# Altium schematic sheet DC075B_TGC_SOURCE.SchDoc: TGC SOURCE
size 558 x 431 mm; Date: Not shown in title block; ApprovedBy: Not shown in title block; CheckedBy: Not shown in title block; Author: Not shown in title block; CompanyName: Not shown in title block; DrawnBy: Praveen Aroul; Engineer: Not shown in title block; Organization: Not shown in title block; Address1: Not shown in title block; Address2: Not shown in title block; Address3: Not shown in title block; Address4: Not shown in title block; DocumentNumber: 8; Revision: Use project parameter SCH_Rev; SheetNumber: 8; SheetTotal: 13; PageSetup: Record=PageOptions|CenterHorizontal=True|CenterVertical=True|PrintScale=1.00|XCorrection=1.00|YCorrection=1.00|PrintKind=0|BorderSize=5000000|LeftOffset=0|BottomOffset=0|Orientation=2|PaperLength=1000|PaperWidth=1000|Scale=100|PaperSource=15|PrintQuality=600|MediaType=1|DitherType=10|PaperKind=Letter|PrintScaleMode=1; CurrentTime: Not shown in title block; CurrentDate: Not shown in title block; Time: Not shown in title block; DocumentFullPathAndName: Not shown in title block; DocumentName: Not shown in title block; ModifiedDate: Not shown in title block; ImagePath: Not shown in title block
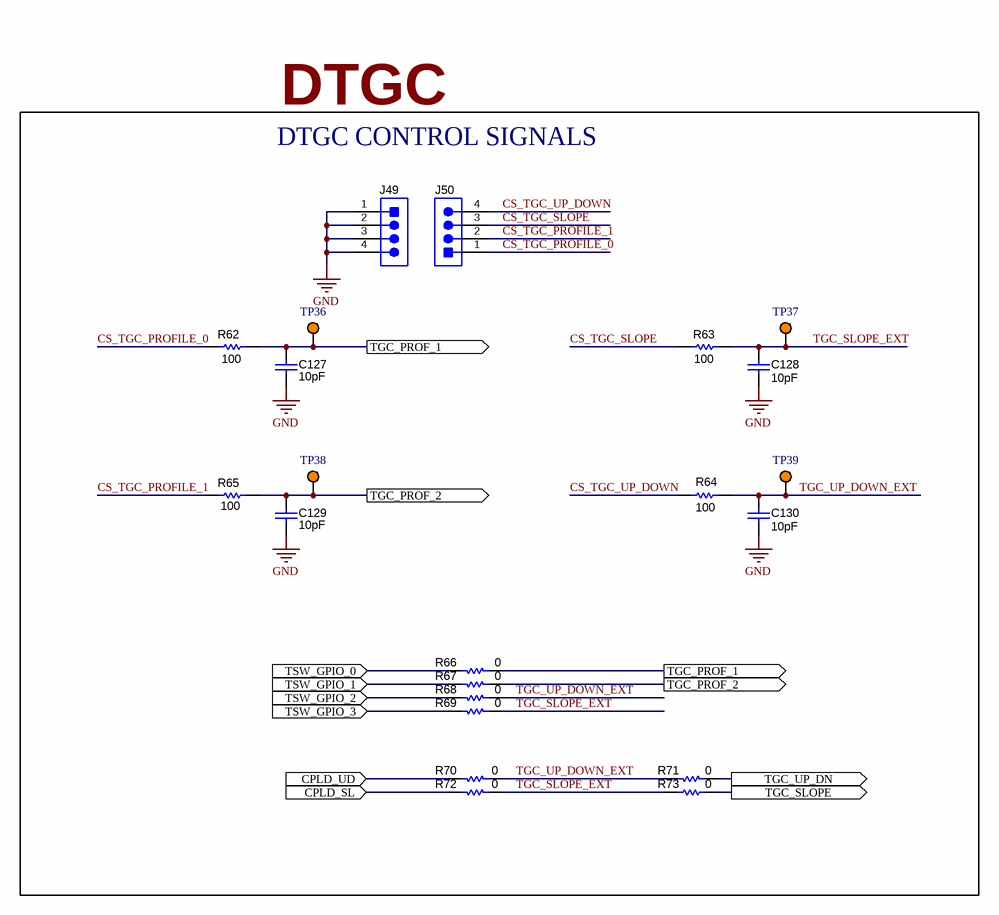
[diagram p0: DC075B_TGC_SOURCE.SchDoc]

## Parts
C127  ValueDisplayed: 10pF  [0402]  (hidden comment: C0402C100C8GACTU)
C128  value 10pF  [0402]  (hidden comment: Capacitor)
C129  ValueDisplayed: 10pF  [0402]  (hidden comment: C0402C100C8GACTU)
C130  value 10pF  [0402]  (hidden comment: Capacitor)
J49  Header_4x1  [TSW-104-07-G-S]  (value not drawn)
J50  Header_4x1  [TSW-104-07-G-S]  (value not drawn)
R62  value 100  [0603]  (hidden comment: Resistor)
R63  value 100  [0603]  (hidden comment: Resistor)
R64  value 100  [0603]  (hidden comment: Resistor)
R65  value 100  [0603]  (hidden comment: Resistor)
R66  value 0  [0402]  (hidden comment: Resistor)
R67  value 0  [0402]  (hidden comment: Resistor)
R68  value 0  [0402]  (hidden comment: Resistor)
R69  value 0  [0402]  (hidden comment: Resistor)
R70  value 0  [0402]  (hidden comment: Resistor)
R71  value 0  [0402]  (hidden comment: Resistor)
R72  value 0  [0402]  (hidden comment: Resistor)
R73  value 0  [0402]  (hidden comment: Resistor)
TP36  5003  [Keystone5003]  (value not drawn)
TP37  5003  [Keystone5003]  (value not drawn)
TP38  5003  [Keystone5003]  (value not drawn)
TP39  5003  [Keystone5003]  (value not drawn)

## Blocks framed on the sheet
DTGC CONTROL SIGNALS: C127-C130 J49 J50 R62-R73 TP36-TP39

## Ports
CPLD_SL (in), CPLD_UD (in), TGC_PROF_1 (out), TGC_PROF_2 (out), TGC_SLOPE (out), TGC_UP_DN (out), TSW_GPIO_0 (in), TSW_GPIO_1 (in), TSW_GPIO_2 (in), TSW_GPIO_3 (in)

## Nets
GND: C127.2 C128.2 C129.2 C130.2 J49.1 J49.2 J49.3 J49.4
CPLD_SL: R72.1 ; port CPLD_SL
CPLD_UD: R70.1 ; port CPLD_UD
CS_TGC_PROFILE_0: J50.1 R62.1
CS_TGC_PROFILE_1: J50.2 R65.1
CS_TGC_SLOPE: J50.3 R63.1
CS_TGC_UP_DOWN: J50.4 R64.1
TGC_PROF_1: C127.1 R62.2 R66.2 TP36.1 ; port TGC_PROF_1
TGC_PROF_2: C129.1 R65.2 R67.2 TP38.1 ; port TGC_PROF_2
TGC_SLOPE: R73.1 ; port TGC_SLOPE
TGC_SLOPE_EXT: C128.1 R63.2 R69.2 R72.2 R73.2 TP37.1
TGC_UP_DN: R71.1 ; port TGC_UP_DN
TGC_UP_DOWN_EXT: C130.1 R64.2 R68.2 R70.2 R71.2 TP39.1
TSW_GPIO_0: R66.1 ; port TSW_GPIO_0
TSW_GPIO_1: R67.1 ; port TSW_GPIO_1
TSW_GPIO_2: R68.1 ; port TSW_GPIO_2
TSW_GPIO_3: R69.1 ; port TSW_GPIO_3

## Notes on the sheet
- DTGC
- Drawn By:
- SVN Rev:
- Number:
- TID #:
- Orderable:
- Rev:
- Sheet Title:
- File:
- Project Title:
- Designed for:
- Assembly Variant:
- Mod. Date:
- Sheet:
- Size:
- of
- C
- http://www.ti.com
- Texas Instruments and/or its licensors do not warrant the accuracy or completeness of this specification or any information contained therein. Texas Instruments and/or its licensors do not warrant that this design will meet the specifications, will be suitable for your application or fit for any particular purpose, or will operate in an implementation. Texas Instruments and/or its licensors do not warrant that the design is production worthy. You should completely validate and test your design implementation to confirm the system functionality for your application.
- Engineer:
- Contact:
- © Texas Instruments

## Library data of the parts
C127 C129 = CMP-0064914-2: CAP, CERM, 10 pF, 10 V,+/- 2.5%, C0G/NP0, 0402; Manufacturer: Kemet; TaMin_C: -55°C; Polarized: N; SizeAreaWB_mm2: 3; Value1: Unknown; U/M: EA; Value: 10pF; TaMax_C: 125°C; SizeZ_mm: 0.6; SizeX_mm: 1; SizeY_mm: 0.5; Value2: 10V; CompType: Capacitor; AEC Category: Q200; Supplier Part Number 2: 96Y6847; Publisher: Texas Instruments; Supplier 2: Newark; Supplier Part Number 3: 80-C0402C100C8G; TempCo: C0G/NP0; Supplier 3: Mouser; Published: 2008-06-19; RoHS: Y; MountType: SMT; Supplier 1: Digi-Key; PackageReference: 0402; Tolerance_%: 2.5%; Cap_Case: 0402; SizeArea_mm2: 0.5; LatestRevisionDate: 2017-06-05; PartNumber: C0402C100C8GACTU; AEC Qualified: N; Cap_F: 10pF; VDC_V: 10V; ComponentLink1Description: Datasheet link; AEC Grade: N/A; Supplier Part Number 1: 399-8939-1-ND; Technology: Ceramic; ComponentLink1URL: http://www.kemet.com/docfinder?Partnumber=C0402C100C8GACTU
C128 C130 = CMP-0006408-2: CAP, CERM, 10 pF, 50 V, +/- 5%, C0G/NP0, 0402; PartNumber: GRM1555C1H100JA01D; Manufacturer: MuRata; Polarized: N; U/M: EA; Value1: Unknown; VDC_V: 50V; TaMin_C: -55°C; TaMax_C: 125°C; AEC Category: Q200; SizeArea_mm2: 0.5; SizeAreaWB_mm2: 3; SizeX_mm: 1; SizeZ_mm: 0.6; CompType: Capacitor; PackageReference: 0402; RoHS: Y; MountType: SMT; ComponentLink1Description: Datasheet link; ComponentLink1URL: http://search.murata.co.jp/Ceramy/PnsearchViewAction.do?HnOFG=ON&HnNFG=ON&SEL_CNT=50&sLang=en&sKey=GRM1555C1H100JA01D&x=9&y=9&search=startwith; ValueDisplayed: 10pF; Cap_F: 10pF; Tolerance_%: 5%; Value2: 50V; Technology: Ceramic; TempCo: C0G/NP0; Cap_Case: 0402; Published: 2008-06-19; Publisher: Texas Instruments; LatestRevisionDate: 2017-03-09; Supplier 1: Mouser; Supplier Part Number 1: 81-GRM1555C1H100JA1D; AEC Qualified: ?; SizeY_mm: 0.5
J49 J50 = CMP-0075409-2: Header, 100mil, 4x1, Gold, TH; Manufacturer: Samtec; Cert_CSA: Y; Cert_CULUS: N; Current_A: 6.3A; Gender: Male; Green_Lifecycle: Active; Green_REACh: Passed; Pitch_mm: 2.54; Row_Count: 1; Voltage_V: 550V; PartNumber: TSW-104-07-G-S; ClassName: Header; PackageReference: 4x1 Header; CompType: Header; RoHS: Y; MountType: TH; ComponentLink1Description: Datasheet URL; ComponentLink1URL: http://samtec.com/ftppub/pdf/TSW_TH.PDF; Supplier 1: Digi-Key; Supplier Part Number 1: SAM1029-04-ND; Cert_UL: Y; Cert_VDE: N; Color: Black; ContactFinish: Gold; Green_EU RoHS-2: Passed; Green_EU RoHS: Passed; Orientation: Vertical; PinCount: 4; Shrouded: N
R62-R65 = CMP-0021991-4: RES, 100, 1%, 0.1 W, AEC-Q200 Grade 0, 0603; Manufacturer: Vishay-Dale; PartNumber: CRCW0603100RFKEA; Value_Code: 100R; Power_W: 100mW; Value2: 0.1W; VDC_V: 75V; TempCo: 100 ppm/C; EIA_Code: E96; AEC Category: Q200; AEC Grade: 0; AEC Qualified: Y; SizeArea_mm2: 1.28; SizeX_mm: 1.6; SizeY_mm: 0.8; SizeZ_mm: 1; ComponentLink1Description: Datasheet link; ComponentLink1URL: http://www.vishay.com/docs/20035/dcrcwe3.pdf; CompType: Resistor; MountType: SMT; PackageReference: 0603; RoHS: E; ValueDisplayed: 100; Res_ohm: 100; Tolerance_%: 1%; Value1: 1%; Technology: Thick Film; Supplier 1: Digi-Key; Supplier Part Number 1: 541-100HCT-ND; Supplier 2: Newark; Supplier Part Number 2: 52K8078; Supplier 3: Mouser; Supplier Part Number 3: 71-CRCW0603-100-E3
R66-R73 = CMP-0026822-3: RES, 0, 5%, 0.063 W, AEC-Q200 Grade 0, 0402; Manufacturer: Vishay-Dale; PartNumber: CRCW04020000Z0ED; Value_Code: 0000; Power_W: 63mW; Value2: 0.063W; VDC_V: 50V; TempCo: 200 ppm/C; EIA_Code: E24; AEC Category: Q200; AEC Qualified: Y; SizeArea_mm2: 0.5; SizeX_mm: 1; SizeZ_mm: 0.6; ComponentLink1Description: Datasheet link; ComponentLink1URL: http://www.vishay.com/docs/20035/dcrcwe3.pdf; CompType: Resistor; MountType: SMT; PackageReference: 0402; RoHS: E; ValueDisplayed: 0; Res_ohm: 0; Tolerance_%: 5%; Value1: 5%; Technology: Thick Film; Supplier 1: Digi-Key; Supplier Part Number 1: 541-0.0JCT-ND; Supplier 2: Newark; Supplier Part Number 2: 52K6543; Supplier 3: Mouser; Supplier Part Number 3: 71-CRCW0402-0-E3; AEC Grade: 0; SizeY_mm: 0.5
TP36-TP39 = CMP-0055140-1: Test Point, Miniature, Orange, TH; Manufacturer: Keystone; CNHeader: FALSE; ContactFinish: Silver; CT: TRUE; Green_Lifecycle: Active; Green_REACh: Passed; PartNumber: 5003; PackageReference: Orange Miniature Testpoint; CompType: Test Point; RoHS: Y; MountType: TH; ComponentLink1Description: Datasheet URL; ComponentLink1URL: http://www.keyelco.com/userAssets/file/M60-2p60.pdf; Publisher: Texas Instruments; LatestRevisionDate: 26/05/2017; Supplier 1: Digi-Key; Supplier Part Number 1: 36-5003-ND; Supplier 2: Mouser; Supplier Part Number 2: 534-5003; Color: Orange; Green_EU RoHS-2: Incomplete; Green_EU RoHS: Passed